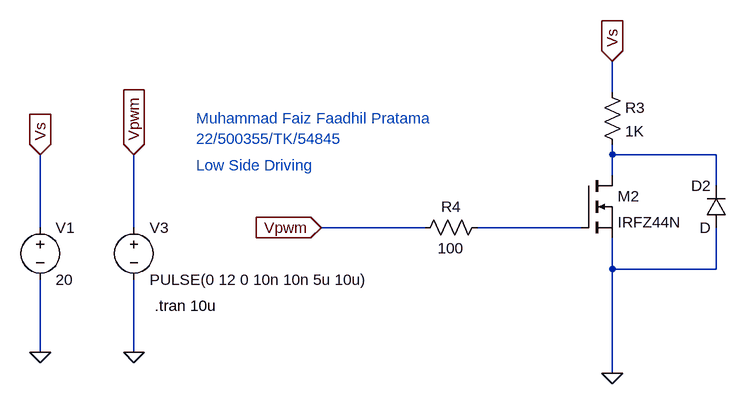
[diagram p0: schematic LOW SIDE DRIVING.asc]
LOW SIDE DRIVING.asc, the LTspice schematic file:
Version 4
SHEET 1 880 680
WIRE 400 -432 400 -480
WIRE 400 -336 400 -352
WIRE 560 -336 400 -336
WIRE 400 -304 400 -336
WIRE 560 -288 560 -336
WIRE -480 -224 -480 -336
WIRE -336 -224 -336 -336
WIRE 112 -224 -48 -224
WIRE 352 -224 192 -224
WIRE 400 -160 400 -208
WIRE 560 -160 560 -224
WIRE 560 -160 400 -160
WIRE -480 -32 -480 -144
WIRE -336 -32 -336 -144
WIRE 400 0 400 -160
FLAG 400 0 0
FLAG 400 -480 Vs
IOPIN 400 -480 In
FLAG -48 -224 Vpwm
IOPIN -48 -224 In
FLAG -480 -336 Vs
IOPIN -480 -336 In
FLAG -480 -32 0
FLAG -336 -336 Vpwm
IOPIN -336 -336 In
FLAG -336 -32 0
SYMBOL nmos 352 -304 R0
SYMATTR InstName M2
SYMATTR Value IRFZ44N
SYMBOL res 384 -448 R0
SYMATTR InstName R3
SYMATTR Value 1K
SYMBOL diode 576 -224 R180
WINDOW 0 24 64 Left 2
WINDOW 3 24 0 Left 2
SYMATTR InstName D2
SYMBOL res 208 -240 R90
WINDOW 0 0 56 VBottom 2
WINDOW 3 32 56 VTop 2
SYMATTR InstName R4
SYMATTR Value 100
SYMBOL voltage -480 -240 R0
WINDOW 123 0 0 Left 0
WINDOW 39 0 0 Left 0
SYMATTR InstName V1
SYMATTR Value 20
SYMBOL voltage -336 -240 R0
WINDOW 123 0 0 Left 0
WINDOW 39 0 0 Left 0
SYMATTR InstName V3
SYMATTR Value PULSE(0 12 0 10n 10n 5u 10u)
TEXT -304 -104 Left 2 !.tran 10u
TEXT -240 -392 Left 2 ;Muhammad Faiz Faadhil Pratama\n22/500355/TK/54845
TEXT -240 -320 Left 2 ;Low Side Driving

The netlist it stands for:
* LOW SIDE DRIVING.asc
M2 N001 N002 0 0 IRFZ44N
R3 Vs N001 1K
D2 0 N001 D
R4 N002 Vpwm 100
V1 Vs 0 20
V3 Vpwm 0 PULSE(0 12 0 10n 10n 5u 10u)
.model D D
.lib standard.dio
.model NMOS NMOS
.model PMOS PMOS
.lib standard.mos
.tran 10u
* Muhammad Faiz Faadhil Pratama
* 22/500355/TK/54845
* Low Side Driving
.backanno
.end